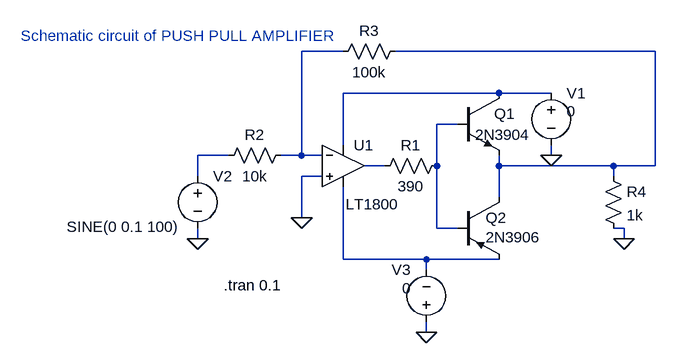
[diagram p0: schematic Pushpull.asc]
Pushpull.asc, the LTspice schematic file:
Version 4
SHEET 1 880 680
WIRE 176 -16 112 -16
WIRE 656 -16 256 -16
WIRE 416 48 176 48
WIRE 496 48 416 48
WIRE 352 96 320 96
WIRE 176 128 176 48
WIRE 0 144 -48 144
WIRE 112 144 112 -16
WIRE 112 144 80 144
WIRE 144 144 112 144
WIRE 496 144 496 128
WIRE 240 160 208 160
WIRE 320 160 320 96
WIRE 416 160 416 144
WIRE 592 160 416 160
WIRE 656 160 656 -16
WIRE 656 160 592 160
WIRE -48 176 -48 144
WIRE 144 176 112 176
WIRE 592 176 592 160
WIRE 416 208 416 160
WIRE 112 240 112 176
WIRE 320 256 320 160
WIRE 352 256 320 256
WIRE 608 256 592 256
WIRE -48 272 -48 256
WIRE 608 272 608 256
WIRE 176 304 176 192
WIRE 304 304 176 304
WIRE 416 304 304 304
WIRE 304 320 304 304
WIRE 304 416 304 400
FLAG -48 272 0
FLAG 496 144 0
FLAG 304 416 0
FLAG 608 272 0
FLAG 112 240 0
SYMBOL Opamps\\LT1800 176 96 R0
WINDOW 3 4 123 Left 2
SYMATTR InstName U1
SYMBOL npn 352 48 R0
WINDOW 3 27 64 Left 2
SYMATTR Value 2N3904
SYMATTR InstName Q1
SYMBOL pnp 352 208 R0
WINDOW 0 43 32 Left 2
WINDOW 3 43 62 Left 2
SYMATTR InstName Q2
SYMATTR Value 2N3906
SYMBOL res 224 176 R270
WINDOW 0 32 56 VTop 2
WINDOW 3 0 56 VBottom 2
SYMATTR InstName R1
SYMATTR Value 390
SYMBOL res -16 160 R270
WINDOW 0 32 56 VTop 2
WINDOW 3 0 56 VBottom 2
SYMATTR InstName R2
SYMATTR Value 10k
SYMBOL res 160 0 R270
WINDOW 0 32 56 VTop 2
WINDOW 3 0 56 VBottom 2
SYMATTR InstName R3
SYMATTR Value 100k
SYMBOL res 576 160 R0
SYMATTR InstName R4
SYMATTR Value 1k
SYMBOL voltage 496 32 R0
WINDOW 3 24 44 Left 2
WINDOW 123 0 0 Left 2
WINDOW 39 0 0 Left 2
SYMATTR Value 0
SYMATTR InstName V1
SYMBOL voltage -48 160 R0
WINDOW 3 -201 94 Left 2
WINDOW 123 0 0 Left 2
WINDOW 39 0 0 Left 2
SYMATTR Value SINE(0 0.1 100)
SYMATTR InstName V2
SYMBOL voltage 304 416 R180
WINDOW 0 24 96 Left 2
WINDOW 3 24 68 Left 2
WINDOW 123 0 0 Left 2
WINDOW 39 0 0 Left 2
SYMATTR InstName V3
SYMATTR Value 0
TEXT -8 344 Left 2 !.tran 0.1
TEXT -320 -40 Left 2 ;Schematic circuit of PUSH PULL AMPLIFIER

The netlist it stands for:
* Pushpull.asc
XU1 0 N001 N003 N007 N006 LT1800  ; pins In+ In- V+ V- OUT
Q1 N003 N004 N002 0 2N3904
Q2 N002 N004 N007 0 2N3906
R1 N006 N004 390
R2 N005 N001 10k
R3 N001 N002 100k
R4 N002 0 1k
V1 N003 0 0
V2 N005 0 SINE(0 0.1 100)
V3 0 N007 0
.model NPN NPN
.model PNP PNP
.lib standard.bjt
.tran 0.1
* Schematic circuit of PUSH PULL AMPLIFIER
.backanno
.end